# Altium schematic sheet s2m.SchDoc
size A; SheetNumber: 1; SheetTotal: 1
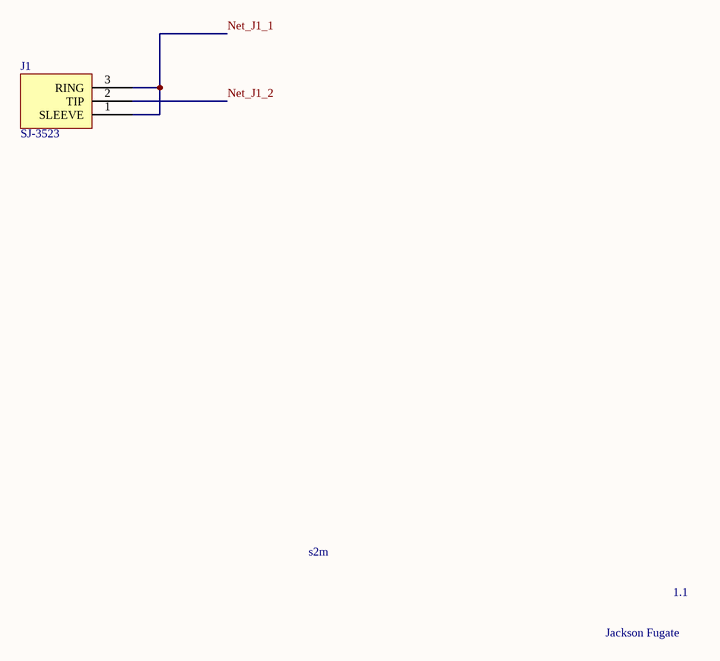
[diagram p0: s2m.SchDoc]

## Parts
J1  SJ-3523  [SJ-352X]

## Nets
Net_J1_1: J1.1(SLEEVE) J1.3(RING)
Net_J1_2: J1.2(TIP)

## Notes on the sheet
- s2m
- 1.1
- Jackson Fugate